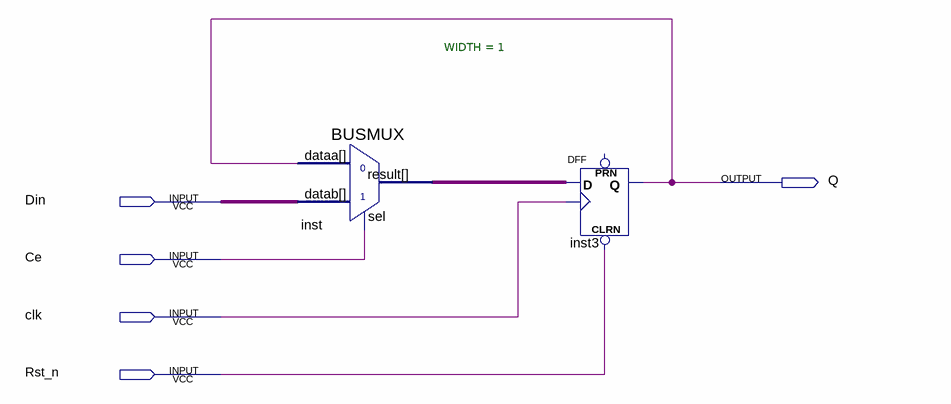
[diagram p0: schematic sheet]
// Quartus schematic work2.bdf as structural Verilog: 2 symbols, 5 pins
module work2 (
  input  Din,
  input  Ce,
  input  clk,
  input  Rst_n,
  output Q
);

  wire inst_result;

  BUSMUX #(.WIDTH(1)) inst (.datab(Din), .sel(Ce), .dataa(Q), .result(inst_result));
  DFF inst3 (.CLRN(Rst_n), .CLK(clk), .D(inst_result), .Q(Q));  // open: PRN
endmodule
